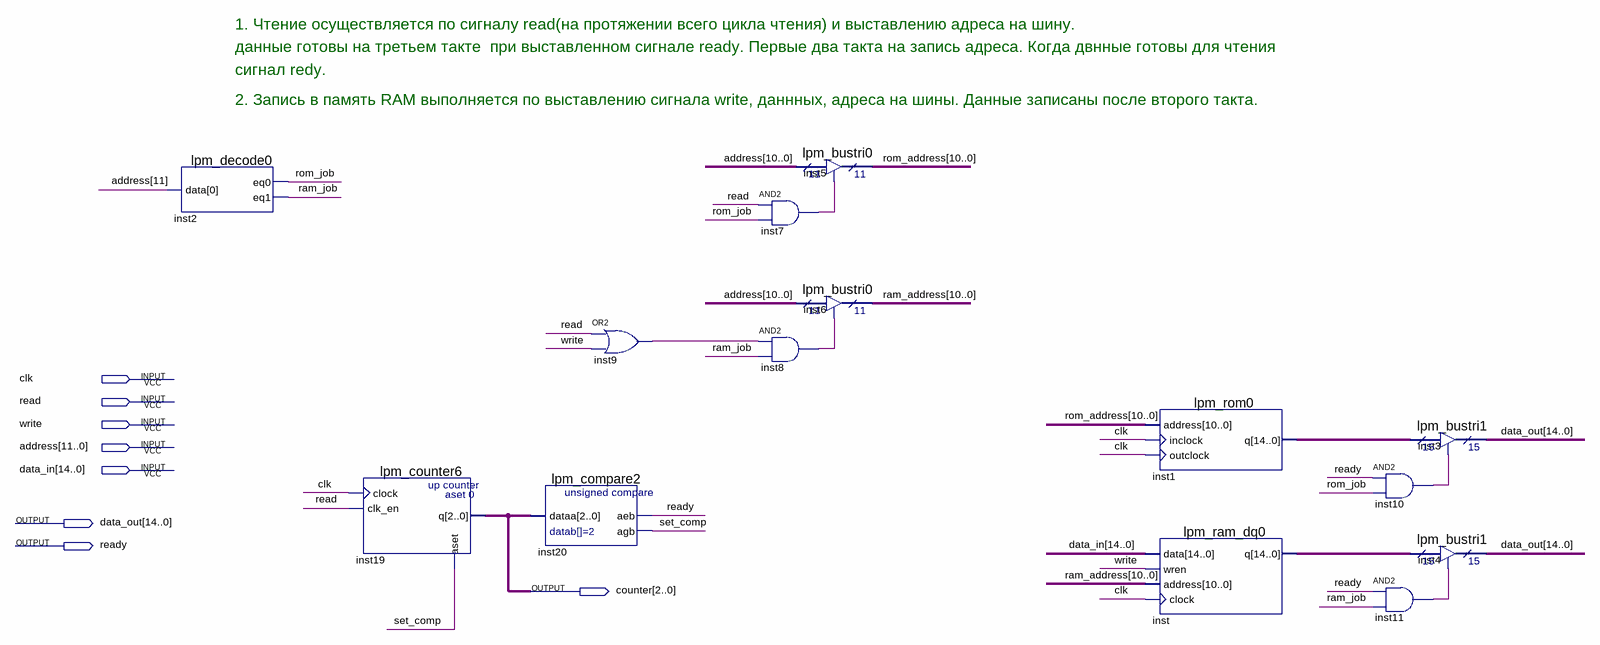
[diagram p0: schematic sheet]
// Quartus schematic memory_0.bdf as structural Verilog: 14 symbols, 8 pins
module memory_0 (
  input  clk,
  input  read,
  input  write,
  input  [11:0] address,
  input  [14:0] data_in,
  output [14:0] data_out,
  output ready,
  output [2:0] counter
);

  wire inst7_out, inst8_out, inst9_out, inst10_out, inst11_out, ram_job, rom_job, set_comp;
  wire [10:0] ram_address, rom_address;
  wire [14:0] inst1_q, inst_q;

  lpm_decode0 inst2 (.data(address[11]), .eq0(rom_job), .eq1(ram_job));
  lpm_counter6 inst19 (.clock(clk), .clk_en(read), .aset(set_comp), .q(counter));
  lpm_compare2 inst20 (.dataa(counter), .aeb(ready), .agb(set_comp));
  or inst9 (inst9_out, read, write);
  lpm_bustri0 inst5 (.enabledt(inst7_out), .data(address[10:0]), .tridata(rom_address));
  and inst7 (inst7_out, read, rom_job);
  lpm_bustri0 inst6 (.enabledt(inst8_out), .data(address[10:0]), .tridata(ram_address));
  and inst8 (inst8_out, inst9_out, ram_job);
  lpm_rom0 inst1 (.address(rom_address), .inclock(clk), .outclock(clk), .q(inst1_q));
  lpm_ram_dq0 inst (.data(data_in), .wren(write), .address(ram_address), .clock(clk), .q(inst_q));
  lpm_bustri1 inst3 (.enabledt(inst10_out), .data(inst1_q), .tridata(data_out));
  and inst10 (inst10_out, ready, rom_job);
  lpm_bustri1 inst4 (.enabledt(inst11_out), .data(inst_q), .tridata(data_out));
  and inst11 (inst11_out, ready, ram_job);

  // Notes on the sheet:
  //   1. Чтение осуществляется по сигналу read(на протяжении всего цикла чтения) и выставлению адреса на шину.
  //   данные готовы на третьем такте  при выставленном сигнале ready. Первые два такта на запись адреса. Когда двнные готовы для чтения
  //   сигнал redy.
  //   2. Запись в память RAM выполняется по выставлению сигнала write, даннных, адреса на шины. Данные записаны после второго такта.
endmodule
